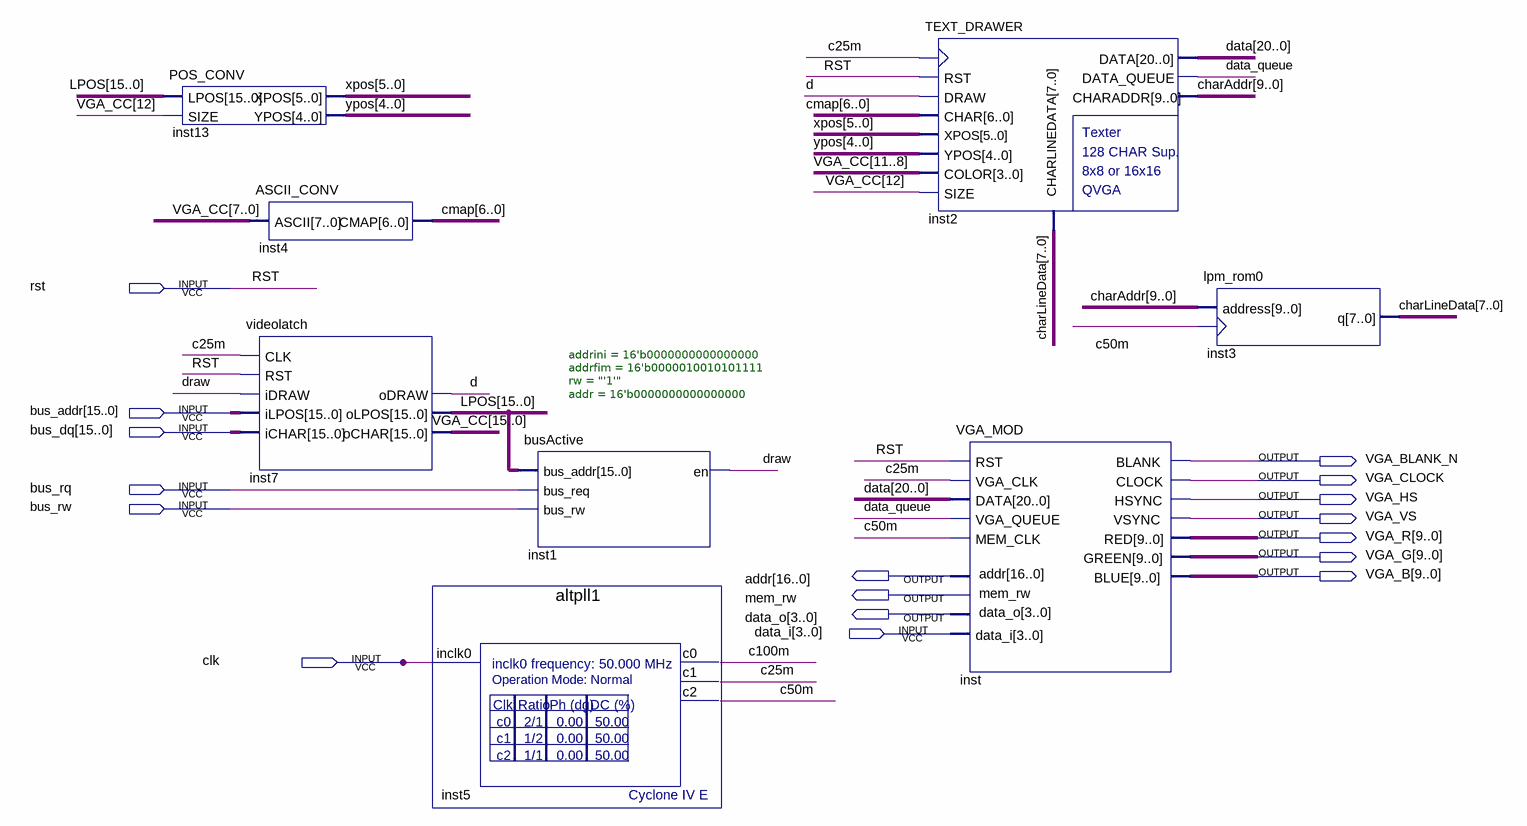
[diagram p0: schematic sheet]
// Quartus schematic VIDEO.bdf as structural Verilog: 8 symbols, 17 pins
module VIDEO (
  input  rst,
  input  [15:0] bus_addr,
  input  [15:0] bus_dq,
  input  bus_rq,
  input  bus_rw,
  input  [3:0] data_i,
  input  clk,
  output VGA_BLANK_N,
  output VGA_CLOCK,
  output VGA_HS,
  output VGA_VS,
  output [9:0] VGA_R,
  output [9:0] VGA_G,
  output [16:0] addr,
  output [9:0] VGA_B,
  output mem_rw,
  output [3:0] data_o
);

  wire c25m, c50m, c100m, d, data_queue, draw;
  wire [4:0] ypos;
  wire [5:0] xpos;
  wire [6:0] cmap;
  wire [7:0] charLineData;
  wire [9:0] charAddr;
  wire [15:0] LPOS, VGA_CC;
  wire [20:0] data;

  POS_CONV inst13 (.LPOS(LPOS), .SIZE(VGA_CC[12]), .XPOS(xpos), .YPOS(ypos));
  videolatch inst7 (
    .CLK(c25m), .RST(rst), .iDRAW(draw), .iLPOS(bus_addr), .iCHAR(bus_dq), .oDRAW(d), .oLPOS(LPOS),
    .oCHAR(VGA_CC));
  ASCII_CONV inst4 (.ASCII(VGA_CC[7:0]), .CMAP(cmap));
  altpll1 inst5 (.inclk0(clk), .c0(c100m), .c1(c25m), .c2(c50m));
  busActive #(.addrini(16'b0000000000000000), .addrfim(16'b0000010010101111), .rw("'1'"), .addr(16'b0000000000000000)) inst1 (
    .bus_addr(LPOS), .bus_req(bus_rq), .bus_rw(bus_rw), .en(draw));
  TEXT_DRAWER inst2 (
    .RST(rst), .DRAW(d), .XPOS(xpos), .YPOS(ypos), .COLOR(VGA_CC[11:8]), .SIZE(VGA_CC[12]),
    .CHARLINEDATA(charLineData), .CLK(c25m), .CHAR(cmap), .DATA(data), .DATA_QUEUE(data_queue),
    .CHARADDR(charAddr));
  VGA_MOD inst (
    .RST(rst), .VGA_CLK(c25m), .data_i(data_i), .DATA(data), .VGA_QUEUE(data_queue), .MEM_CLK(c50m),
    .BLANK(VGA_BLANK_N), .CLOCK(VGA_CLOCK), .HSYNC(VGA_HS), .VSYNC(VGA_VS), .RED(VGA_R), .addr(addr),
    .GREEN(VGA_G), .BLUE(VGA_B), .mem_rw(mem_rw), .data_o(data_o));
  lpm_rom0 inst3 (.clock(c50m), .address(charAddr), .q(charLineData));
endmodule
